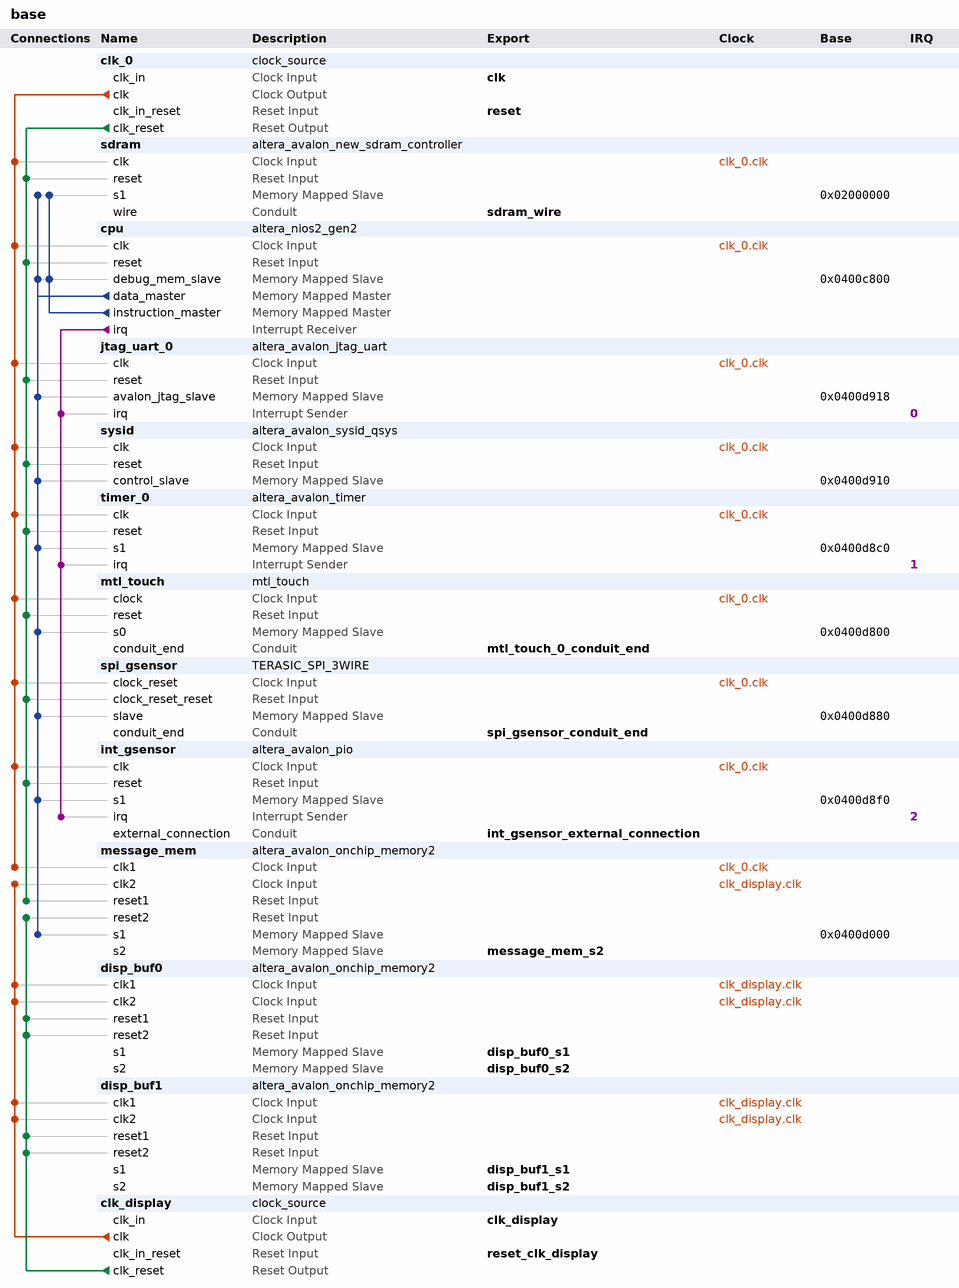
[diagram p0: system contents]
# Platform Designer (Qsys) system base, Cyclone IV E EP4CE22F17C6
# Parameters at their usual value, and those the tool derives, are not listed.
package require -exact qsys 15.0
create_system base
set_project_property DEVICE_FAMILY {Cyclone IV E}
set_project_property DEVICE EP4CE22F17C6

add_instance clk_0 clock_source 15.0
set_instance_parameter_value clk_0 clockFrequency 50000000

add_instance sdram altera_avalon_new_sdram_controller 15.0
set_instance_parameter_value sdram TAC 5.5
set_instance_parameter_value sdram TRCD 20.0
set_instance_parameter_value sdram TRP 20.0
set_instance_parameter_value sdram casLatency 3
set_instance_parameter_value sdram columnWidth 9
set_instance_parameter_value sdram dataWidth 16
set_instance_parameter_value sdram generateSimulationModel false
set_instance_parameter_value sdram model single_Micron_MT48LC4M32B2_7_chip
set_instance_parameter_value sdram numberOfBanks 4
set_instance_parameter_value sdram numberOfChipSelects 1
set_instance_parameter_value sdram powerUpDelay 100.0
set_instance_parameter_value sdram refreshPeriod 15.625
set_instance_parameter_value sdram rowWidth 13

add_instance cpu altera_nios2_gen2 15.0
set_instance_parameter_value cpu dcache_size 2048
set_instance_parameter_value cpu exceptionSlave sdram.s1
set_instance_parameter_value cpu icache_size 4096
set_instance_parameter_value cpu impl Tiny
set_instance_parameter_value cpu resetSlave sdram.s1

add_instance jtag_uart_0 altera_avalon_jtag_uart 15.0
set_instance_parameter_value jtag_uart_0 simInteractiveOptions NO_INTERACTIVE_WINDOWS

add_instance sysid altera_avalon_sysid_qsys 15.0
set_instance_parameter_value sysid id 1383429720

add_instance timer_0 altera_avalon_timer 15.0
set_instance_parameter_value timer_0 period 1
set_instance_parameter_value timer_0 periodUnits MSEC

add_instance mtl_touch mtl_touch 1.0

add_instance spi_gsensor TERASIC_SPI_3WIRE 1.0

add_instance int_gsensor altera_avalon_pio 15.0
set_instance_parameter_value int_gsensor captureEdge true
set_instance_parameter_value int_gsensor direction Input
set_instance_parameter_value int_gsensor generateIRQ true
set_instance_parameter_value int_gsensor irqType EDGE
set_instance_parameter_value int_gsensor width 1

add_instance message_mem altera_avalon_onchip_memory2 15.0
set_instance_parameter_value message_mem dataWidth 32
set_instance_parameter_value message_mem dualPort true
set_instance_parameter_value message_mem initMemContent false
set_instance_parameter_value message_mem initializationFileName onchip_mem.hex
set_instance_parameter_value message_mem memorySize 1024

add_instance disp_buf0 altera_avalon_onchip_memory2 15.0
set_instance_parameter_value disp_buf0 dataWidth 32
set_instance_parameter_value disp_buf0 dualPort true
set_instance_parameter_value disp_buf0 initMemContent false
set_instance_parameter_value disp_buf0 initializationFileName onchip_mem.hex
set_instance_parameter_value disp_buf0 memorySize 12000

add_instance disp_buf1 altera_avalon_onchip_memory2 15.0
set_instance_parameter_value disp_buf1 dataWidth 32
set_instance_parameter_value disp_buf1 dualPort true
set_instance_parameter_value disp_buf1 initMemContent false
set_instance_parameter_value disp_buf1 initializationFileName onchip_mem.hex
set_instance_parameter_value disp_buf1 memorySize 12000

add_instance clk_display clock_source 15.0
set_instance_parameter_value clk_display clockFrequency 33000000

# connections
add_connection clk_0.clk cpu.clk clock
add_connection clk_0.clk int_gsensor.clk clock
add_connection clk_0.clk jtag_uart_0.clk clock
add_connection clk_0.clk message_mem.clk1 clock
add_connection clk_0.clk mtl_touch.clock clock
add_connection clk_0.clk sdram.clk clock
add_connection clk_0.clk spi_gsensor.clock_reset clock
add_connection clk_0.clk sysid.clk clock
add_connection clk_0.clk timer_0.clk clock
add_connection clk_display.clk disp_buf0.clk1 clock
add_connection clk_display.clk disp_buf0.clk2 clock
add_connection clk_display.clk disp_buf1.clk1 clock
add_connection clk_display.clk disp_buf1.clk2 clock
add_connection clk_display.clk message_mem.clk2 clock
add_connection clk_0.clk_reset cpu.reset reset
add_connection clk_0.clk_reset int_gsensor.reset reset
add_connection clk_0.clk_reset jtag_uart_0.reset reset
add_connection clk_0.clk_reset message_mem.reset1 reset
add_connection clk_0.clk_reset mtl_touch.reset reset
add_connection clk_0.clk_reset sdram.reset reset
add_connection clk_0.clk_reset spi_gsensor.clock_reset_reset reset
add_connection clk_0.clk_reset sysid.reset reset
add_connection clk_0.clk_reset timer_0.reset reset
add_connection clk_display.clk_reset disp_buf0.reset1 reset
add_connection clk_display.clk_reset disp_buf0.reset2 reset
add_connection clk_display.clk_reset disp_buf1.reset1 reset
add_connection clk_display.clk_reset disp_buf1.reset2 reset
add_connection clk_display.clk_reset message_mem.reset2 reset
add_connection cpu.data_master cpu.debug_mem_slave avalon
set_connection_parameter_value cpu.data_master/cpu.debug_mem_slave baseAddress 0x0400c800
add_connection cpu.data_master int_gsensor.s1 avalon
set_connection_parameter_value cpu.data_master/int_gsensor.s1 baseAddress 0x0400d8f0
add_connection cpu.data_master jtag_uart_0.avalon_jtag_slave avalon
set_connection_parameter_value cpu.data_master/jtag_uart_0.avalon_jtag_slave baseAddress 0x0400d918
add_connection cpu.data_master message_mem.s1 avalon
set_connection_parameter_value cpu.data_master/message_mem.s1 baseAddress 0x0400d000
add_connection cpu.data_master mtl_touch.s0 avalon
set_connection_parameter_value cpu.data_master/mtl_touch.s0 baseAddress 0x0400d800
add_connection cpu.data_master sdram.s1 avalon
set_connection_parameter_value cpu.data_master/sdram.s1 baseAddress 0x02000000
add_connection cpu.data_master spi_gsensor.slave avalon
set_connection_parameter_value cpu.data_master/spi_gsensor.slave baseAddress 0x0400d880
add_connection cpu.data_master sysid.control_slave avalon
set_connection_parameter_value cpu.data_master/sysid.control_slave baseAddress 0x0400d910
add_connection cpu.data_master timer_0.s1 avalon
set_connection_parameter_value cpu.data_master/timer_0.s1 baseAddress 0x0400d8c0
add_connection cpu.instruction_master cpu.debug_mem_slave avalon
set_connection_parameter_value cpu.instruction_master/cpu.debug_mem_slave baseAddress 0x0400c800
add_connection cpu.instruction_master sdram.s1 avalon
set_connection_parameter_value cpu.instruction_master/sdram.s1 baseAddress 0x02000000
add_connection cpu.irq int_gsensor.irq interrupt
set_connection_parameter_value cpu.irq/int_gsensor.irq irqNumber 2
add_connection cpu.irq jtag_uart_0.irq interrupt
set_connection_parameter_value cpu.irq/jtag_uart_0.irq irqNumber 0
add_connection cpu.irq timer_0.irq interrupt
set_connection_parameter_value cpu.irq/timer_0.irq irqNumber 1

# exported interfaces
add_interface clk clock sink
set_interface_property clk EXPORT_OF clk_0.clk_in
add_interface clk_display clock sink
set_interface_property clk_display EXPORT_OF clk_display.clk_in
add_interface disp_buf0_s1 avalon slave
set_interface_property disp_buf0_s1 EXPORT_OF disp_buf0.s1
add_interface disp_buf0_s2 avalon slave
set_interface_property disp_buf0_s2 EXPORT_OF disp_buf0.s2
add_interface disp_buf1_s1 avalon slave
set_interface_property disp_buf1_s1 EXPORT_OF disp_buf1.s1
add_interface disp_buf1_s2 avalon slave
set_interface_property disp_buf1_s2 EXPORT_OF disp_buf1.s2
add_interface int_gsensor_external_connection conduit end
set_interface_property int_gsensor_external_connection EXPORT_OF int_gsensor.external_connection
add_interface message_mem_s2 avalon slave
set_interface_property message_mem_s2 EXPORT_OF message_mem.s2
add_interface mtl_touch_0_conduit_end conduit end
set_interface_property mtl_touch_0_conduit_end EXPORT_OF mtl_touch.conduit_end
add_interface reset reset sink
set_interface_property reset EXPORT_OF clk_0.clk_in_reset
add_interface reset_clk_display reset sink
set_interface_property reset_clk_display EXPORT_OF clk_display.clk_in_reset
add_interface sdram_wire conduit end
set_interface_property sdram_wire EXPORT_OF sdram.wire
add_interface spi_gsensor_conduit_end conduit end
set_interface_property spi_gsensor_conduit_end EXPORT_OF spi_gsensor.conduit_end

set_interconnect_requirement {$system} qsys_mm.clockCrossingAdapter HANDSHAKE
set_interconnect_requirement {$system} qsys_mm.enableEccProtection FALSE
set_interconnect_requirement {$system} qsys_mm.insertDefaultSlave FALSE
set_interconnect_requirement {$system} qsys_mm.maxAdditionalLatency 1

save_system base.qsys
